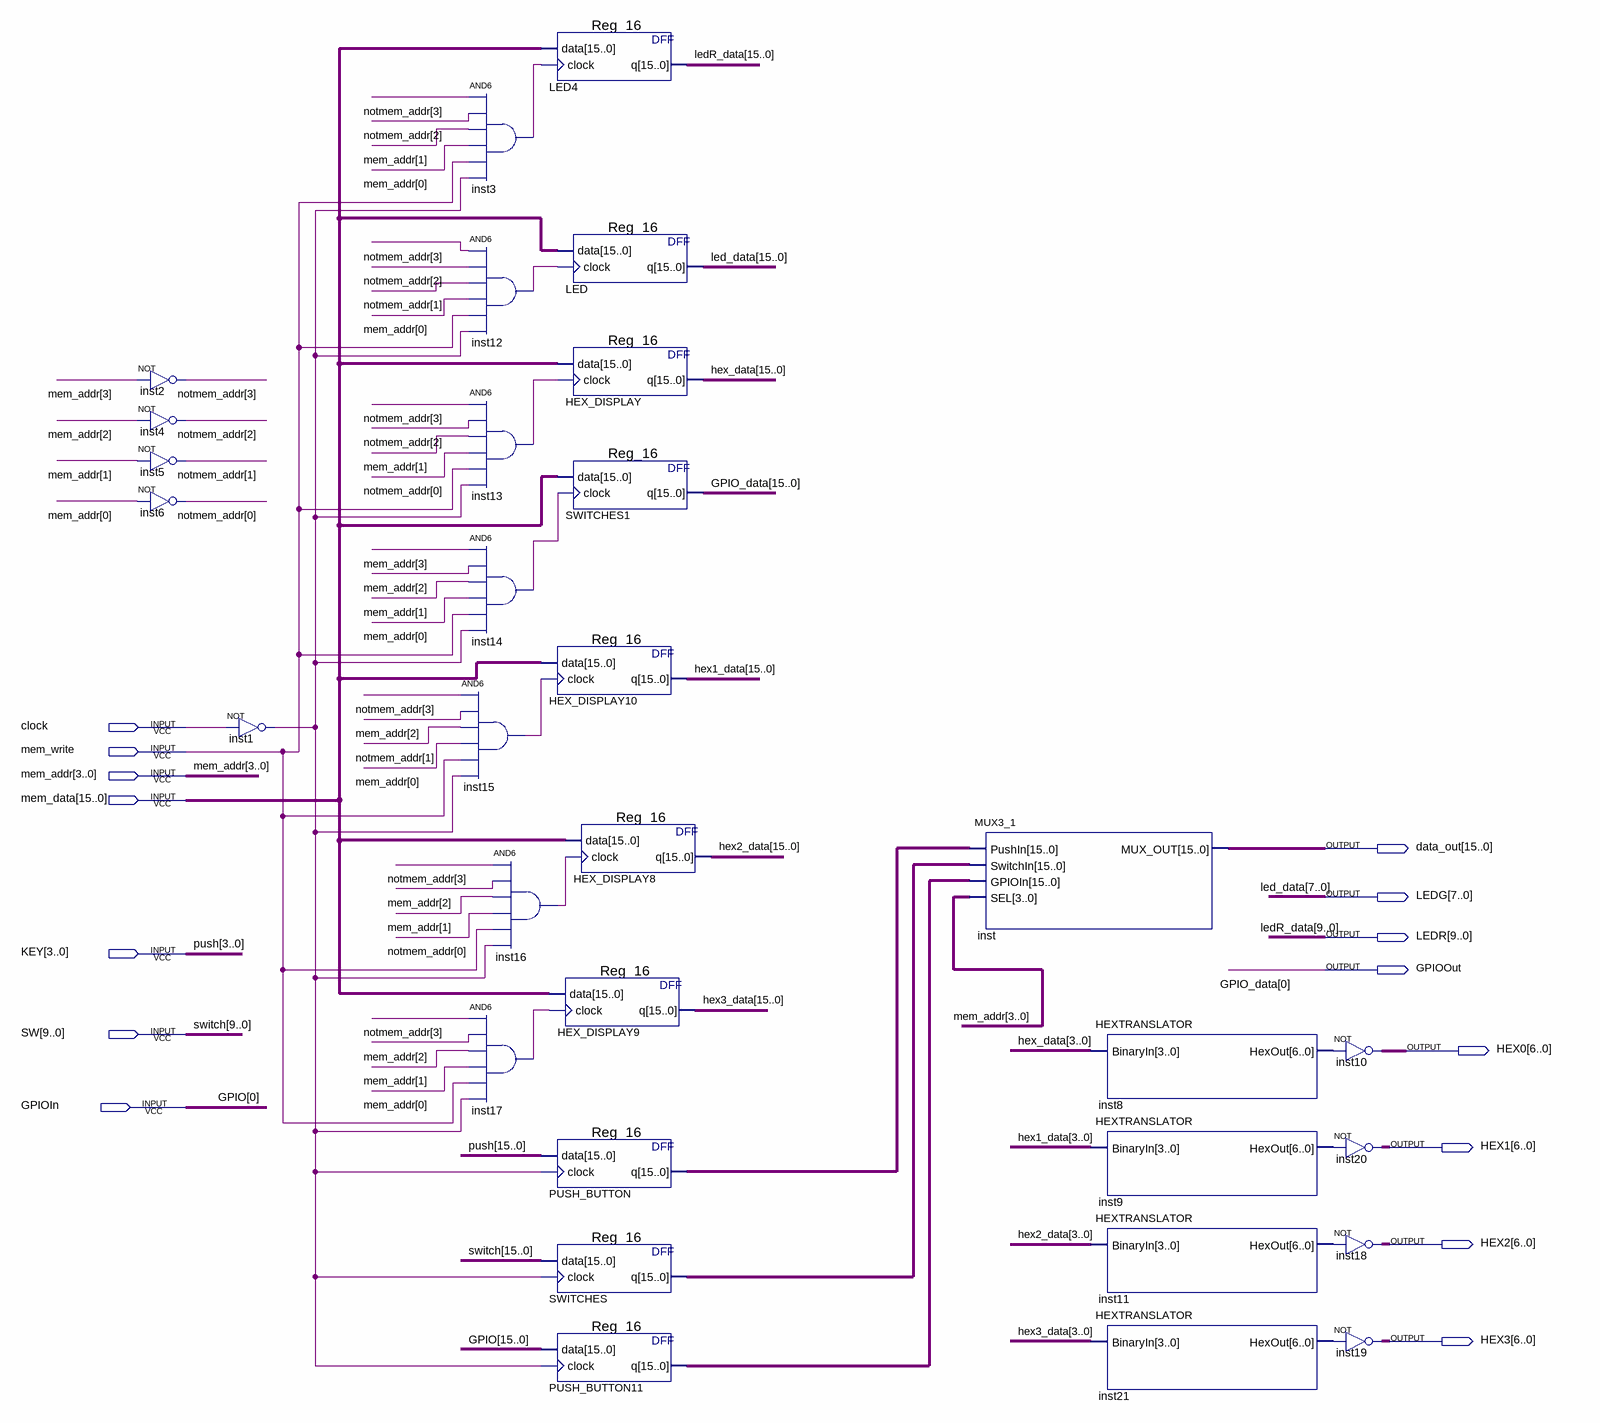
[diagram p0: schematic sheet]
// Quartus schematic IO_MemoryInterface.bdf as structural Verilog: 31 symbols, 15 pins
module IO_MemoryInterface (
  input  clock,
  input  mem_write,
  input  [3:0] mem_addr,
  input  [15:0] mem_data,
  input  [3:0] KEY,
  input  [9:0] SW,
  input  GPIOIn,
  output [15:0] data_out,
  output [7:0] LEDG,
  output [9:0] LEDR,
  output GPIOOut,
  output [6:0] HEX0,
  output [6:0] HEX1,
  output [6:0] HEX2,
  output [6:0] HEX3
);

  wire inst1_out, inst3_out, inst12_out, inst13_out, inst14_out, inst15_out, inst16_out, inst17_out;
  wire [3:0] notmem_addr;
  wire [6:0] inst8_hexout, inst9_hexout, inst11_hexout, inst21_hexout;
  wire [15:0] hex1_data, hex2_data, hex3_data, hex_data, PUSH_BUTTON11_q, PUSH_BUTTON_q, SWITCHES_q;
  wire [15:1] GPIO, GPIO_data;
  wire [15:4] push;
  wire [15:8] led_data;
  wire [15:10] ledR_data, switch;

  not inst2 (notmem_addr[3], mem_addr[3]);
  not inst4 (notmem_addr[2], mem_addr[2]);
  not inst5 (notmem_addr[1], mem_addr[1]);
  not inst6 (notmem_addr[0], mem_addr[0]);
  not inst1 (inst1_out, clock);
  and inst3 (inst3_out, notmem_addr[3], notmem_addr[2], mem_addr[1], mem_addr[0], mem_write, inst1_out);
  and inst12 (inst12_out, notmem_addr[3], notmem_addr[2], notmem_addr[1], mem_addr[0], mem_write, inst1_out);
  and inst13 (inst13_out, notmem_addr[3], notmem_addr[2], mem_addr[1], notmem_addr[0], mem_write, inst1_out);
  and inst14 (inst14_out, mem_addr[3], mem_addr[2], mem_addr[1], mem_addr[0], mem_write, inst1_out);
  and inst15 (inst15_out, notmem_addr[3], mem_addr[2], notmem_addr[1], mem_addr[0], mem_write, inst1_out);
  and inst17 (inst17_out, notmem_addr[3], mem_addr[2], mem_addr[1], mem_addr[0], mem_write, inst1_out);
  Reg_16 LED4 (.data(mem_data), .clock(inst3_out), .q({ledR_data, LEDR}));
  Reg_16 HEX_DISPLAY10 (.data(mem_data), .clock(inst15_out), .q(hex1_data));
  and inst16 (inst16_out, notmem_addr[3], mem_addr[2], mem_addr[1], notmem_addr[0], mem_write, inst1_out);
  Reg_16 HEX_DISPLAY9 (.data(mem_data), .clock(inst17_out), .q(hex3_data));
  Reg_16 PUSH_BUTTON (.data({push, KEY}), .clock(inst1_out), .q(PUSH_BUTTON_q));
  Reg_16 SWITCHES (.data({switch, SW}), .clock(inst1_out), .q(SWITCHES_q));
  Reg_16 PUSH_BUTTON11 (.data({GPIO, GPIOIn}), .clock(inst1_out), .q(PUSH_BUTTON11_q));
  Reg_16 LED (.data(mem_data), .clock(inst12_out), .q({led_data, LEDG}));
  Reg_16 HEX_DISPLAY (.data(mem_data), .clock(inst13_out), .q(hex_data));
  Reg_16 SWITCHES1 (.data(mem_data), .clock(inst14_out), .q({GPIO_data, GPIOOut}));
  Reg_16 HEX_DISPLAY8 (.data(mem_data), .clock(inst16_out), .q(hex2_data));
  MUX3_1 inst (
    .PushIn(PUSH_BUTTON_q), .SwitchIn(SWITCHES_q), .GPIOIn(PUSH_BUTTON11_q), .SEL(mem_addr),
    .MUX_OUT(data_out));
  HEXTRANSLATOR inst8 (.BinaryIn(hex_data[3:0]), .HexOut(inst8_hexout));
  HEXTRANSLATOR inst9 (.BinaryIn(hex1_data[3:0]), .HexOut(inst9_hexout));
  HEXTRANSLATOR inst11 (.BinaryIn(hex2_data[3:0]), .HexOut(inst11_hexout));
  HEXTRANSLATOR inst21 (.BinaryIn(hex3_data[3:0]), .HexOut(inst21_hexout));
  assign HEX0 = ~inst8_hexout;  // NOT inst10, 7 bits wide
  assign HEX1 = ~inst9_hexout;  // NOT inst20, 7 bits wide
  assign HEX2 = ~inst11_hexout;  // NOT inst18, 7 bits wide
  assign HEX3 = ~inst21_hexout;  // NOT inst19, 7 bits wide

  // Other names for the same wires on the sheet: GPIO[0] = GPIOIn; GPIO_data[0] = GPIOOut; led_data[7:0] = LEDG;
  //   ledR_data[9:0] = LEDR; push[3:0] = KEY; switch[9:0] = SW
endmodule
